# Altium schematic sheet Valve3.SchDoc
size A
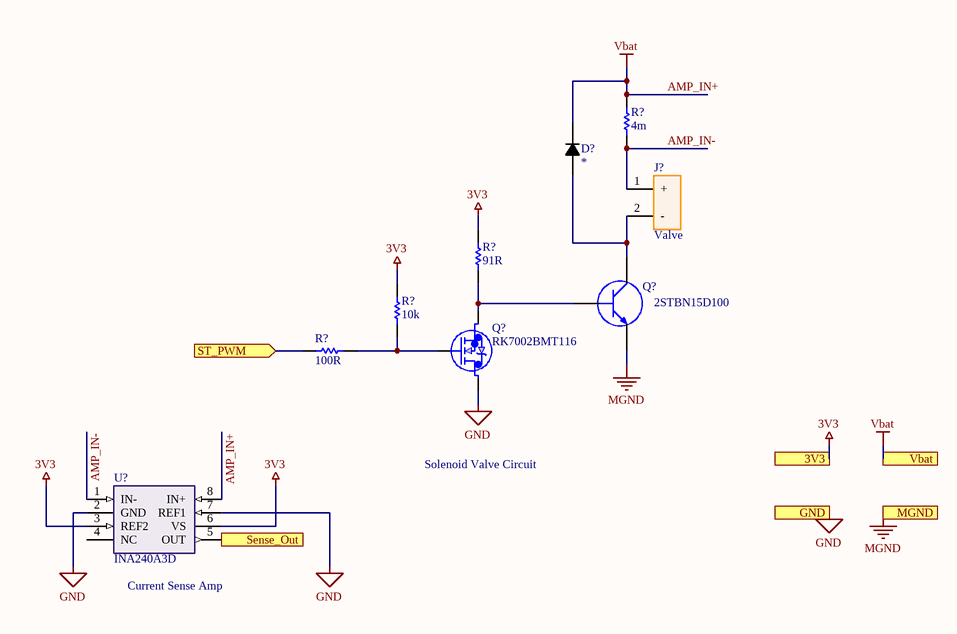
[diagram p0: Valve3.SchDoc]

## Parts
(Parts that share a designator on the sheet are numbered #1, #2 ... from top to bottom, then left to right.)
D?  *  [DO-35]
J?  Valve  [MOLEX_436500200 - duplicate]
Q?#1  2STBN15D100  [D2PAK]
Q?#2  RK7002BMT116  [TRANS_RK7002BMHZG_ROM]
R?#1  value 4m  [R0402_low_density]  (hidden comment: ResChip)
R?#2  value 91R  [R0402_low_density]  (hidden comment: ResChip)
R?#3  value 10k  [R0402_low_density]  (hidden comment: ResChip)
R?#4  value 100R  [R0402_low_density]  (hidden comment: ResChip)
U?  INA240A3D  [INA240A3D]

## Ports
3V3, GND, MGND, Sense_Out (out), ST_PWM (in), Vbat

## Nets
3V3: R?#2.1 R?#3.1 U?.3(REF2) U?.6(VS) ; port 3V3
AMP_IN+: D?.2 R?#1.1 U?.8(IN+) ; port Vbat  [also labelled Vbat]
GND: Q?#2.1 U?.2(GND) U?.7(REF1) ; port GND
MGND: Q?#1.3(B) ; port MGND
AMP_IN-: J?.1(+) R?#1.2 U?.1(IN-)
Sense_Out: U?.5(OUT) ; port Sense_Out
ST_PWM: R?#4.2 ; port ST_PWM
NetD?_1: D?.1 J?.2(-) Q?#1.1(B)
NetQ?#1_2: Q?#1.2(B) Q?#2.3 R?#2.2
NetQ?#2_2: Q?#2.2 R?#3.2 R?#4.1

Not connected (* = marked no-connect by the designer): U? 4(NC)

## Notes on the sheet
- Solenoid Valve Circuit
- (near U?) Current Sense Amp

## Library data of the parts
D? = Diode: General purpose diode; PartNumber: *; Package: *
J? = General Molex
Q?#1 = BJT: 2STBN15D100 BJT; DC Gain: 750; Part Number: 2STBN15D100; Supplier 1: Digi-Key; Supplier Part Number 1: 497-10113-1-ND
Q?#2 = RK7002BMT116: n-channel MOSEFT; Vendor: ROHM Semiconductor; Built_By: EMA_Matt; SourceLibrary: Rohm_2019-09-23; Type: DEV; Manufacturer_Part_Number: RK7002BMT116; Copyright: Copyright (C) 2018 Accelerated Designs. All rights reserved; RefDes: RefDes
R?#1 = ResChip: SMD Chip resistor; Rating: 1 W; Tolerance: *; Package: *
R?#2 = ResChip: SMD Chip resistor; Rating: 0.25 W; Tolerance: *; Package: *
R?#3 R?#4 = ResChip: SMD Chip resistor; Rating: 0.125 W; Tolerance: *; Package: *
U? = INA240A3D: SchLib for TI op amp for current sensing.; Supplier 1: Digi-Key; Supplier Part Number 1: 296-48839-ND